# Altium schematic sheet automotive-mirror-communication-pin-terminals.SchDoc
size 141 x 76 mm
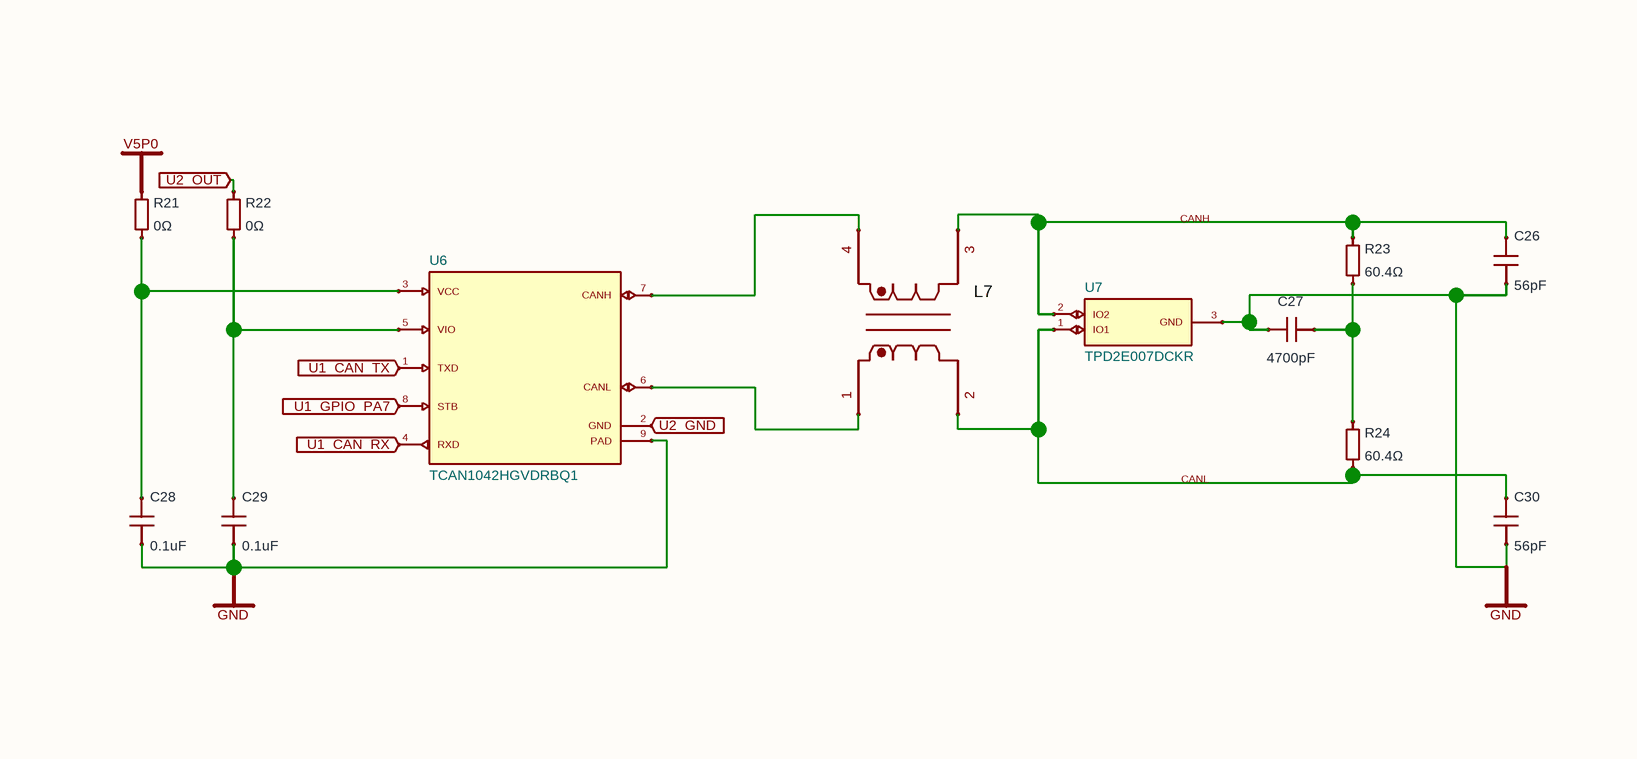
[diagram p0: automotive-mirror-communication-pin-terminals.SchDoc]

## Parts
C26  56pF
C27  4700pF
C28  0.1uF
C29  0.1uF
C30  56pF
L7  (no value)
R21  0Ω
R22  0Ω
R23  60.4Ω
R24  60.4Ω
U6  (no value)
U7  (no value)

## Nets
GND: C26.2(cathode) C27.1(pos) C28.2(cathode) C29.2(cathode) C30.2(cathode) U6.9(PAD) U7.3(GND)
V5P0: R21.1(anode)
U1_CAN_RX: U6.4(RXD)
U1_CAN_TX: U6.1(TXD)
U1_GPIO_PA7: U6.8(STB)
U2_GND: U6.2(GND)
U2_OUT: R22.1(anode)
NetC26_1: C26.1(anode) L7.3(pin3) R23.1(anode) U7.2(IO2)
NetC27_2: C27.2(neg) R23.2(cathode) R24.1(anode)
NetC28_1: C28.1(anode) R21.2(cathode) U6.3(VCC)
NetC29_1: C29.1(anode) R22.2(cathode) U6.5(VIO)
NetC30_1: C30.1(anode) L7.2(pin2) R24.2(cathode) U7.1(IO1)
NetL7_1: L7.1(pin1) U6.6(CANL)
NetL7_4: L7.4(pin4) U6.7(CANH)

## Notes on the sheet
- CANH
- CANL
- (in symbol U6) TCAN1042HGVDRBQ1
- (in symbol U7) TPD2E007DCKR

## Library data of the parts
C26 C28-C30 = capacitor_down
C27 = capacitor_right
L7 = L7
R21-R24 = boxresistor_down
U6 = U6
U7 = U7